# Altium schematic sheet Wifi.SchDoc
size B
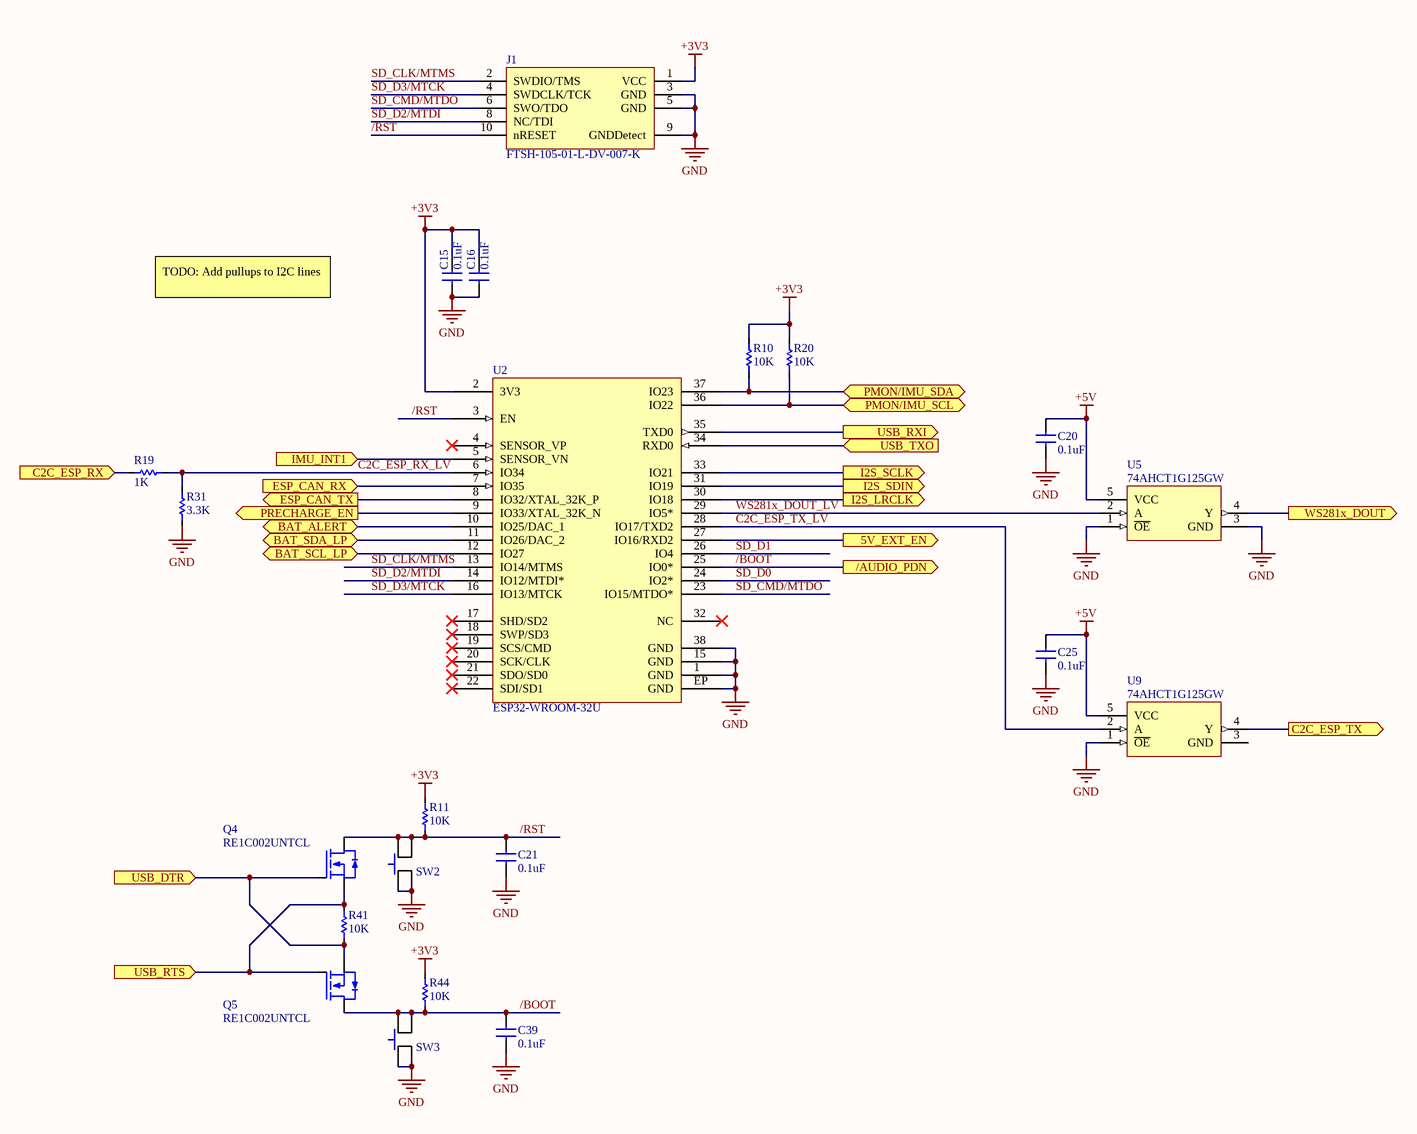
[diagram p0: Wifi.SchDoc]

## Parts
C15  value 0.1uF  [0402_CAPACITOR]  (hidden comment: CAP 0.1uF 16V X7R)
C16  value 0.1uF  [0402_CAPACITOR]  (hidden comment: CAP 0.1uF 16V X7R)
C20  value 0.1uF  [0402_CAPACITOR]  (hidden comment: CAP 0.1uF 16V X7R)
C21  value 0.1uF  [0402_CAPACITOR]  (hidden comment: CAP 0.1uF 16V X7R)
C25  value 0.1uF  [0402_CAPACITOR]  (hidden comment: CAP 0.1uF 16V X7R)
C39  value 0.1uF  [0402_CAPACITOR]  (hidden comment: CAP 0.1uF 16V X7R)
J1  FTSH-105-01-L-DV-007-K  [J_Cortex_JTAG_SMD]
Q4  RE1C002UNTCL  [EMT3F]
Q5  RE1C002UNTCL  [EMT3F]
R10  value 10K  [0402_Resistor]  (hidden comment: R_0402_10K_1%)
R11  value 10K  [0402_Resistor]  (hidden comment: R_0402_10K_1%)
R19  value 1K  [0402_Resistor]  (hidden comment: R_0402_1K_1%)
R20  value 10K  [0402_Resistor]  (hidden comment: R_0402_10K_1%)
R31  value 3.3K  [0402_Resistor]  (hidden comment: R_0402_3.3K_1%)
R41  value 10K  [0402_Resistor]  (hidden comment: R_0402_10K_1%)
R44  value 10K  [0402_Resistor]  (hidden comment: R_0402_10K_1%)
SW2  KSEM31J_LFS  [SW_6x6mm_SMD]  (value not drawn)
SW3  KSEM31J_LFS  [SW_6x6mm_SMD]  (value not drawn)
U2  ESP32-WROOM-32U  [U_ESP32-WROOM-32U]
U5  74AHCT1G125GW  [SC70-5]
U9  74AHCT1G125GW  [SC70-5]

## Ports
5V_EXT_EN (out), /AUDIO_PDN (out), BAT_ALERT (bidir), BAT_SCL_LP (bidir), BAT_SDA_LP (bidir), C2C_ESP_RX (in), C2C_ESP_TX (out), ESP_CAN_RX (in), ESP_CAN_TX (out), I2S_LRCLK (out), I2S_SCLK (out), I2S_SDIN (out), IMU_INT1 (in), PMON/IMU_SCL (bidir), PMON/IMU_SDA (bidir), PRECHARGE_EN (out), USB_DTR (in), USB_RTS (in), USB_RXI (out), USB_TXO (in), WS281x_DOUT (out)

## Nets
+3V3: C15.1 C16.1 J1.1(VCC) R10.1 R11.1 R20.1 R44.1 U2.2(3V3)
+5V: C20.2 C25.2 U5.5(VCC) U9.5(VCC)
GND: C15.2 C16.2 C20.1 C21.1 C25.1 C39.1 J1.3(GND) J1.5(GND) J1.9(GNDDetect) R31.1 SW2.1 SW2.4 SW3.1 SW3.4 U2.1(GND) U2.15(GND) U2.38(GND) U2.EP(GND) U5.1(~{OE}) U5.3(GND) U9.1(~{OE})
5V_EXT_EN: U2.27(IO16/RXD2) ; port 5V_EXT_EN
/BOOT: C39.2 Q5.3(DRAIN) R44.2 SW3.2 SW3.3 U2.25(IO0*) ; port /AUDIO_PDN
/RST: C21.2 J1.10(nRESET) Q4.3(DRAIN) R11.2 SW2.2 SW2.3 U2.3(EN)
BAT_ALERT: U2.10(IO25/DAC_1) ; port BAT_ALERT
BAT_SCL_LP: U2.12(IO27) ; port BAT_SCL_LP
BAT_SDA_LP: U2.11(IO26/DAC_2) ; port BAT_SDA_LP
C2C_ESP_RX: R19.1 ; port C2C_ESP_RX
C2C_ESP_RX_LV: R19.2 R31.2 U2.6(IO34)
C2C_ESP_TX: U9.4(Y) ; port C2C_ESP_TX
C2C_ESP_TX_LV: U2.28(IO17/TXD2) U9.2(A)
ESP_CAN_RX: U2.7(IO35) ; port ESP_CAN_RX
ESP_CAN_TX: U2.8(IO32/XTAL_32K_P) ; port ESP_CAN_TX
I2S_LRCLK: U2.30(IO18) ; port I2S_LRCLK
I2S_SCLK: U2.33(IO21) ; port I2S_SCLK
I2S_SDIN: U2.31(IO19) ; port I2S_SDIN
IMU_INT1: U2.5(SENSOR_VN) ; port IMU_INT1
PMON/IMU_SCL: R20.2 U2.36(IO22) ; port PMON/IMU_SCL
PMON/IMU_SDA: R10.2 U2.37(IO23) ; port PMON/IMU_SDA
PRECHARGE_EN: U2.9(IO33/XTAL_32K_N) ; port PRECHARGE_EN
SD_CLK/MTMS: J1.2(SWDIO/TMS) U2.13(IO14/MTMS)
SD_CMD/MTDO: J1.6(SWO/TDO) U2.23(IO15/MTDO*)
SD_D0: U2.24(IO2*)
SD_D1: U2.26(IO4)
SD_D2/MTDI: J1.8(NC/TDI) U2.14(IO12/MTDI*)
SD_D3/MTCK: J1.4(SWDCLK/TCK) U2.16(IO13/MTCK)
USB_DTR: Q4.1(GATE) Q5.2(SOURCE) R41.2 ; port USB_DTR
USB_RTS: Q4.2(SOURCE) Q5.1(GATE) R41.1 ; port USB_RTS
USB_RXI: U2.35(TXD0) ; port USB_RXI
USB_TXO: U2.34(RXD0) ; port USB_TXO
WS281x_DOUT: U5.4(Y) ; port WS281x_DOUT
WS281x_DOUT_LV: U2.29(IO5*) U5.2(A)

Not connected (* = marked no-connect by the designer): U2 4(SENSOR_VP)* 17(SHD/SD2)* 18(SWP/SD3)* 19(SCS/CMD)* 20(SCK/CLK)* 21(SDO/SD0)* 22(SDI/SD1)* 32(NC)*; U9 3(GND)

## Notes on the sheet
- TODO: Add pullups to I2C lines

## Library data of the parts
C15 C16 C20 C21 C25 C39 = C_0402_0.1uF_16V_10%: CAP CERM 0.1uF 10% 16V 0402; Package: =SelectedPackage; Voltage: 16V; Temperature Coefficient: X7R; Supplier 1: Digi-Key; Supplier Part Number 1: 1276-1001-1-ND; Supplier 2: Digi-Key; Supplier Part Number 2: 587-1451-1-ND
J1 = J_Cortex_JTAG_SMD: CORTEX JTAG DEBUG CONNECTOR; Manufacturer: Samtec Inc; Manufacturer PN: FTSH-105-01-L-DV-007-K; Supplier 1: Digi-Key; Supplier Part Number 1: SAM9438-ND
Q4 Q5 = Q_RE1C002UNTCL: N-Channel 20V 200mA (Ta) 150mW (Ta) Surface Mount EMT3F (SOT-416FL); Manufacturer: Rohm; Input Capacitance: 25pF; Rds On Max: 1.2R; Supplier 1: Digi-Key; Supplier 2: Mouser; Supplier Part Number 1: RE1C002UNTCLCT-ND; Supplier Part Number 2: 755-RE1C002UNTCL; Continuous Drain Current (ID): 200mA; Drain to Source Voltage (Vdss): 20V; Manufacturer Part Number: RE1C002UNTCL; Max Power Dissipation: 150mW
R10 R11 R19 R20 R31 R41 R44 = R_0402_generic_1%: Generic 0402 Resistor (10.2R to 10M); Manufacturer: Yageo; Power Rating: 0.0625W; Temperature Coefficient: ±100ppm/°C; Tolerance: ±1%; Voltage Rating: 50V; Operating Temperature: -55°C ~ 155°C; Manufacturer Part Number: ='RC0402FR-07'+ValueFormatted+'L'; HelpURL: https://www.digikey.com/products/en/resistors/chip-resistor-surface-mount/52?pv17=103&FV=fffc000d%2Cc0001%2C1c0002%2C1f140000%2Cffe00034&k=RC0402; ValueFormatted: =Copy(Copy(Value, 0, Pos('.', Value)-1)+Copy(Value, Length(Value), 1)+Copy(Value, Pos('.', Value)+1, Length(Value)-Pos('.', Value)-1),1,Pos('.',Value)*Length(Value))+Copy(Value,1,Length(Value)*(1-Pos('.',Value)))
SW2 SW3 = SW_KSEM31J_LFS: Tactile Switch SPST-NO Top Actuated Surface Mount; Package: 6mm x 6mm; Supplier 1: Digi-Key; Supplier Part Number 1: CKN10425CT-ND
U2 = U_ESP32-WROOM-32U: Bluetooth, WiFi 802.11b/g/n, Bluetooth v4.2 + EDR, Class 1, 2 and 3 Transceiver Module 2.4GHz ~ 2.5GHz Integrated, Chip + U.FL Surface Mount; Supplier 1: Digi-Key; Supplier 2: Mouser; Supplier Part Number 1: 1904-1026-1-ND; Supplier Part Number 2: 356-ESP32-WROOM-32U
U5 U9 = U_74AHCT1G125GW: Buffer, Non-Inverting 1 Element 1 Bit per Element 3-State Output 5-TSSOP; Manufacturer: NXP Semiconductors; High Level Output Current: -8mA; Low Level Output Current: 8mA; Max Supply Voltage: 5.5V; Min Supply Voltage: 4.5V; Quiescent Current: 1uA; Propagation Delay: 11ns; Turn-On Delay Time: 9.5ns; Supplier 1: Digi-Key; Supplier 2: Mouser; Supplier Part Number 1: 1727-4055-1-ND; Supplier Part Number 2: 771-74AHCT1G125GW-G; Logic Function: Buffer; Manufacturer Part Number: 74AHCT1G125GW; Max Operating Temperature: 125°C; Min Operating Temperature: -40°C; Polarity: Non-Inverting